# Altium schematic sheet Block_Diagram.SchDoc
size A; SheetNumber: 1; SheetTotal: 8
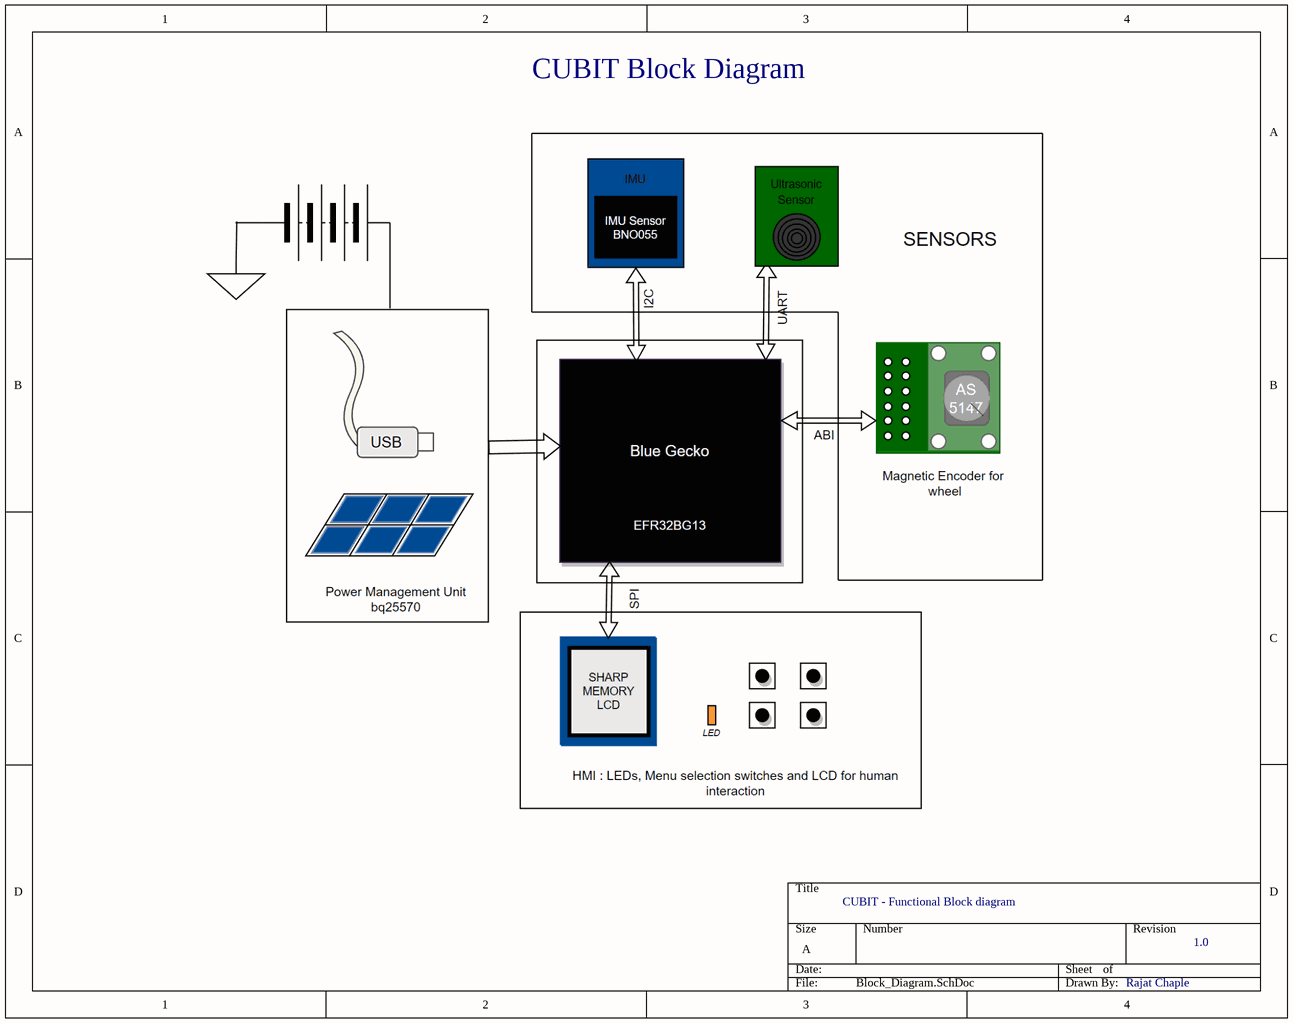
[diagram p0: Block_Diagram.SchDoc]

## Notes on the sheet
- CUBIT Block Diagram
- CUBIT - Functional Block diagram
- 1.0
- Rajat Chaple